# Altium schematic sheet hv_io_rms.SchDoc
size A4; Organization: Badgerloop; Address1: 133 Engineering Research; Address2: Building; Address3: Madison, WI 53715
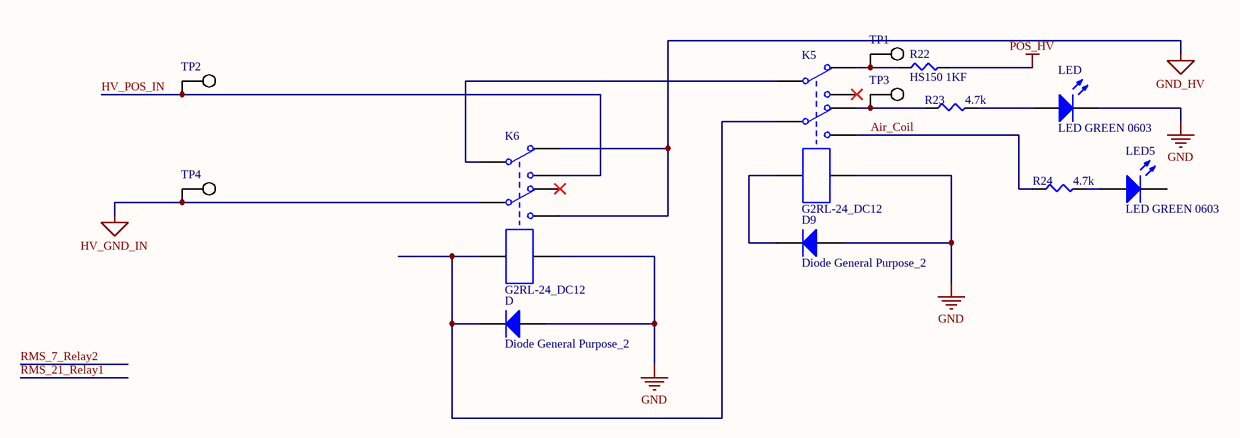
[diagram p0: hv_io_rms.SchDoc]

## Parts
D  Diode General Purpose_2  [SODFL250X110-2N]
D9  Diode General Purpose_2  [SODFL250X110-2N]
K5  G2RL-24_DC12
K6  G2RL-24_DC12
LED  LED GREEN 0603  [LED 0603 GREEN]
LED5  LED GREEN 0603  [LED 0603 GREEN]
R22  HS150 1KF  [HS150 1KF]
R23  4.7k  [SMD-0402-RES]
R24  4.7k  [SMD-0402-RES]
TP1  TP2  [Test Point]  (value not drawn)
TP2  TP2  [Test Point]  (value not drawn)
TP3  TP2  [Test Point]  (value not drawn)
TP4  TP2  [Test Point]  (value not drawn)

## Nets
GND: D.1(A) D9.1(A) K5.8 K6.8 LED.2(K)
GND_HV: K6.2 K6.6
HV_GND_IN: K6.4 TP4.1
POS_HV: R22.2
Air_Coil: K5.6 R24.1
HV_POS_IN: K6.3 TP2.1
NetD9_2: D9.2(K) K5.7
NetD_2: D.2(K) K5.4 K6.7
NetK5_1: K5.1 K6.1
NetK5_2: K5.2 R22.1 TP1.1
NetK5_5: K5.5 R23.1 TP3.1
NetLED5_1: LED5.1(A) R24.2
NetLED_1: LED.1(A) R23.2

Not connected (* = marked no-connect by the designer): K5 3*; K6 5*; LED5 2(K)

## Notes on the sheet
- Title
- Size:
- Date:
- A4
- Number:
- Time:
- Revision:
- Sheet
- of
- File:

## Library data of the parts
D D9 = Diode General Purpose_2: DIODE GEN PURP 20V 350MA SOD323; Manufacturer: Diodes Incorporated; Manufacturer P/N: SD103CWS-7-F; Digikey P/N: SD103CWS-FDIDKR-ND; Package / Case: SOD323; Do Not Populate: *; ComponentLink1Description: Digikey; ComponentLink1URL: https://www.digikey.com/product-detail/en/diodes-incorporated/SD103CWS-7-F/SD103CWS-FDIDKR-ND/1836772; ComponentLink2Description: Datasheet; ComponentLink2URL: https://www.diodes.com/assets/Datasheets/ds30101.pdf; ComponentLink3Description: Dimensions; ComponentLink3URL: https://www.diodes.com/assets/Package-Files/SOD323.pdf
K5 K6 = G2RL-24_DC12: RELAY GEN PURPOSE DPDT 8A 12V; Manufacturer: Omron Electronics; Manufacturer P/N: G2RL-24 DC12; Digikey Link: https://www.digikey.com/product-detail/en/omron-electronics-inc-emc-div/G2RL-24-DC12/Z147-ND/307667; Digikey P/N: Z147-ND
LED LED5 = LED GREEN 0603: Manufacturer: Lite-On Inc.; Manufacturer P/N: LTST-C190KGKT; Digikey P/N: 160-1435-1-ND; Package / Case: 0603; Color: GREEN
R22 = HS150 1KF: 1K Power Resistor; Manufacturer: Ohmite; Digikey Link: https://www.digikey.com/product-detail/en/ohmite/HS150-1KF/HS1501KF-ND/5306251; Digikey P/N: HS1501KF-ND; Manufacturer P/N: HS150 1KF
R23 R24 = ERJ-2GEJ472X: RES SMD 4.7K OHM 5% 1/10W 0402; Manufacturer: Panasonic Electronic Components; Factory Stock: 0; Unit Price (USD): 0.00350; @ qty: 1500; Minimum Quantity: 1; Power (Watts): 0.1W, 1/10W; Temperature Coefficient: ±200ppm/°C; Part Number: ERJ-2GEJ472X; Datasheets: http://industrial.panasonic.com/www-cgi/jvcr13pz.cgi?E+PZ+3+AOA0001+ERJ2GEJ472X+7+WW; Image: //media.digikey.com/Photos/Panasonic%20Photos/ERJ-PA2-Series.jpg; Digi-Key Part Number: P4.7KJCT-ND; Quantity Available: 8551774; Packaging: Cut Tape (CT); Series: ERJ; Part Status: Active; Value: 4.7k; Tolerance: ±5%; Composition: Thick Film; Features: Automotive AEC-Q200; Operating Temperature: -55°C ~ 155°C; Package / Case: 0402 (1005 Metric); Supplier Device Package: 0402; Size / Dimension: 0.039" L x 0.020" W (1.00mm x 0.50mm); Height - Seated (Max): 0.016" (0.40mm); Number of Terminations: 2; Failure Rate: -; Digikey P/N: ERJ-2GEJ472X
TP1-TP4 = TP2: Test Point